# Altium project MegaD-328 16I(Bottom_board).PrjPcb
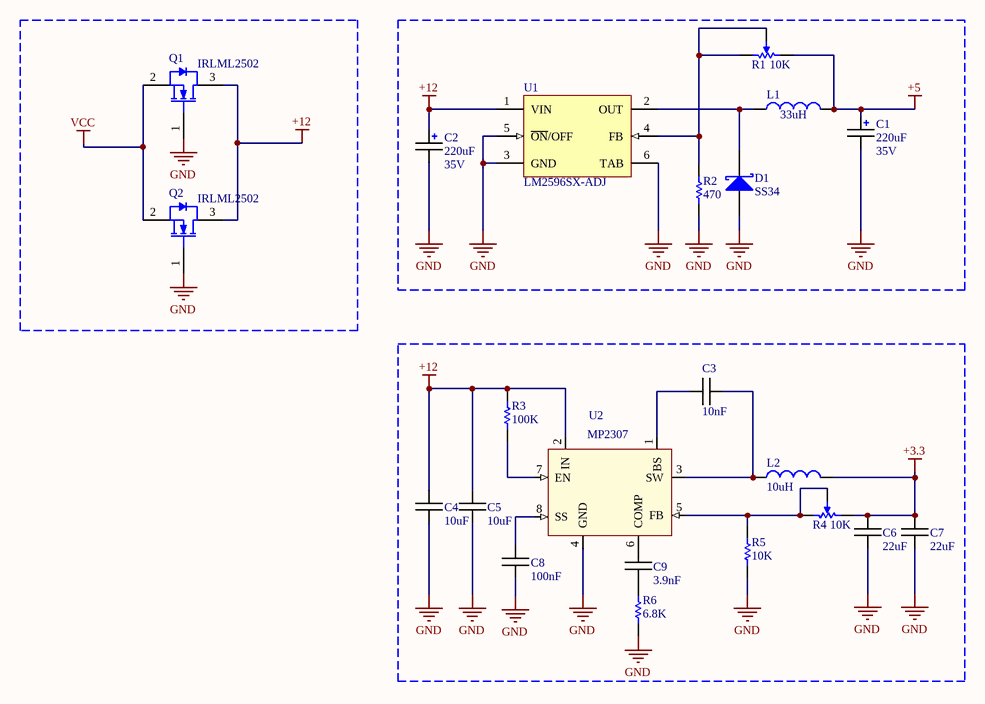
[diagram p0: Power.SchDoc]
2 sheets, 42 parts. Net scope: global (net labels, ports and power ports of the same name join across sheets).
Board file: Bottom_boaard.PcbDoc
Sheets:
  Power.SchDoc
  Bottom_board.SchDoc

## Sheet Power.SchDoc
size A4

### Parts
C1  Rated Capacitance: 220uF  Rated Voltage: 35V  [ECAP_SMD_8mmx10mm]  (hidden comment: CAP_ELEC_SMD)
C2  Rated Capacitance: 220uF  Rated Voltage: 35V  [ECAP_SMD_8mmx10mm]  (hidden comment: CAP_ELEC_SMD)
C3  Val: 10nF  [CAP0805]  (hidden comment: CAP_SMD)
C4  Val: 10uF  [CAPC1206(3216)170_L]  (hidden comment: CAP_SMD)
C5  Val: 10uF  [CAPC1206(3216)170_L]  (hidden comment: CAP_SMD)
C6  Val: 22uF  [CAPC1206(3216)170_L]  (hidden comment: CAP_SMD)
C7  Val: 22uF  [CAPC1206(3216)170_L]  (hidden comment: CAP_SMD)
C8  Val: 100nF  [CAP0805]  (hidden comment: CAP_SMD)
C9  Val: 3.9nF  [CAP0805]  (hidden comment: CAP_SMD)
D1  SS34  [DO-214]
L1  Inductance: 33uH  [SDR1006_SMD]
L2  value 10uH  [IHLP2525]  (hidden comment: Inductor power)
Q1  IRLML2502  [SOT23_L]
Q2  IRLML2502  [SOT23_L]
R1  value 10K  [BOUR-3296W]  (hidden comment: 3296W)
R2  Val: 470  [RES0805]  (hidden comment: RES_SMD)
R3  Val: 100K  [RES0805]  (hidden comment: RES_SMD)
R4  value 10K  [BOUR-3296W]  (hidden comment: 3296W)
R5  Val: 10K  [RES0805]  (hidden comment: RES_SMD)
R6  Val: 6.8K  [RES0805]  (hidden comment: RES_SMD)
U1  LM2596SX-ADJ  [KTT0005B_N]
U2  MP2307  [SOIC8N]

### Nets
+3.3: C6.2 C7.2 L2.2 R4.3
+5: C1.1 L1.2 R1.3
+12: C2.1 C4.2 C5.2 Q1.3(D) Q2.3(D) R3.2 U1.1(VIN) U2.2(IN)
GND: C1.2 C2.2 C4.1 C5.1 C6.1 C7.1 C8.1 D1.2(A) Q1.1(G) Q2.1(G) R2.1 R5.1 R6.1 U1.3(GND) U1.5(~{ON}/OFF) U1.6(TAB) U2.4(GND)
VCC: Q1.2(S) Q2.2(S)
NetC3_1: C3.1 U2.1(BS)
NetC3_2: C3.2 L2.1 U2.3(SW)
NetC8_2: C8.2 U2.8(SS)
NetC9_1: C9.1 R6.2
NetC9_2: C9.2 U2.6(COMP)
NetD1_1: D1.1(K) L1.1 U1.2(OUT)
NetR1_1: R1.1 R1.2 R2.2 U1.4(FB)
NetR3_1: R3.1 U2.7(EN)
NetR4_1: R4.1 R4.2 R5.2 U2.5(FB)

### Library data of the parts
C3-C9 = CAP_SMD: Ceramic capacitor, 0805
D1 = SS34: Schottky Rectifier
L1 = Inductor power: Inductor for Power Circuits; Manufacturer: TDK; Online Catalog: VLCFSeries; Catalog Drawings: VLCF50[20,20-(1,3),28-2]SeriesTopVLCF50[20,20-(1,3),28-2]SeriesFootprintVLCF50[20,20-(1,3)]SeriesSide; Current - Saturation: 2.62A; Frequency - Test: 100kHz; EDA / CAD Models: DownloadfromAcceleratedDesigns; Material - Core: Ferrite; Type: Wirewound; DC Resistance (DCR): 43mOhmMax; Tolerance: ±30%; Shielding: Shielded; Other Names: 445-4557-1; Size / Dimension: 0.197"Lx0.197"W(5.00mmx5.00mm); Datasheet Version: 04/2016; Package Description: 2-Pin Surface Mount Device, Body 5 x 5 mm; Package Reference: VLCF5020T-3; Package / Case: Nonstandard; Series: VLCF; Current Rating: 2.62A; Manufacturer URL: http://www.tdk.com/; Category: Inductors,Coils,Chokes; Height - Seated (Max): 0.079"(2.00mm); Mounting Technology: SurfaceMount; Family: FixedInductors; Datasheet URL: https://product.tdk.com/info/en/catalog/datasheets/inductor_commercial_power_vlcf5020-3_en.pdf; Standard Package: 1; Mounting Type: SurfaceMount; Operating Temperature: -40°C~105°C; Packaging: CutTape(CT)
L2 = Inductor power: Inductor for Power Circuits
Q1 Q2 = IRLML2502: N-Channel HEXFET(R) Power MOSFET, 20 V VDS, +/- 12 V VGS, 4.2 A, 3-Pin SOT23, RoHS, Tape and Reel; Manufacturer: International Rectifier; Drain-to-Source Voltage [Vdss]: 20V; Drain-Source On Resistance-Max: 0.045O; Qg Gate Charge: 8nC; Rated Power Dissipation: 1.25W; Package Reference: SOT-23-3; Manufacturer URL: http://internationalrectifier.com/; Package Description: 3-Pin Small Outline Transistor, Body 2.92 x 1.3 mm, Pitch 0.95 mm; Datasheet Version: Apr-14; Channel Type: N-Channel; Datasheet URL: https://datasheet.ciiva.com/6383/irlml2502pbf-6383216.pdf
R1 R4 = Potentiometer: 3296 - 3/8 ” Square Trimpot(R) Trimming Potentiometer,, +/- 10%, 0.5 W, -55 to 125 degC, 3-Pin THD, RoHS, Tube
U1 = LM2596SX-ADJ: SIMPLE SWITCHER® Power Converter 150 KHz 3A Step-Down Voltage Regulator, 5-pin TO-263; Manufacturer: Texas Instruments; PackageTopMarking: NSUZXYTTE#*LM2596S*-ADJ P+; PowerWise: N; PackageDescription: TO-263, Molded, .400 x .390 x .180in, 5 Lead, .067in Pitch, Surface Mount; RoHS: N; Code_JEDEC: MO-169-AB; CompType: Switcher; ComponentLink1Description: Datasheet URL; PackageReference: KTT0005B; PinCount: 5; ComponentLink1URL: http://www.ti.com/general/docs/lit/getliterature.tsp?genericPartNumber=LM2596&fileType=pdf
U2 = MP2307: Monolithic synchronous buck regulator

## Sheet Bottom_board.SchDoc
size A4
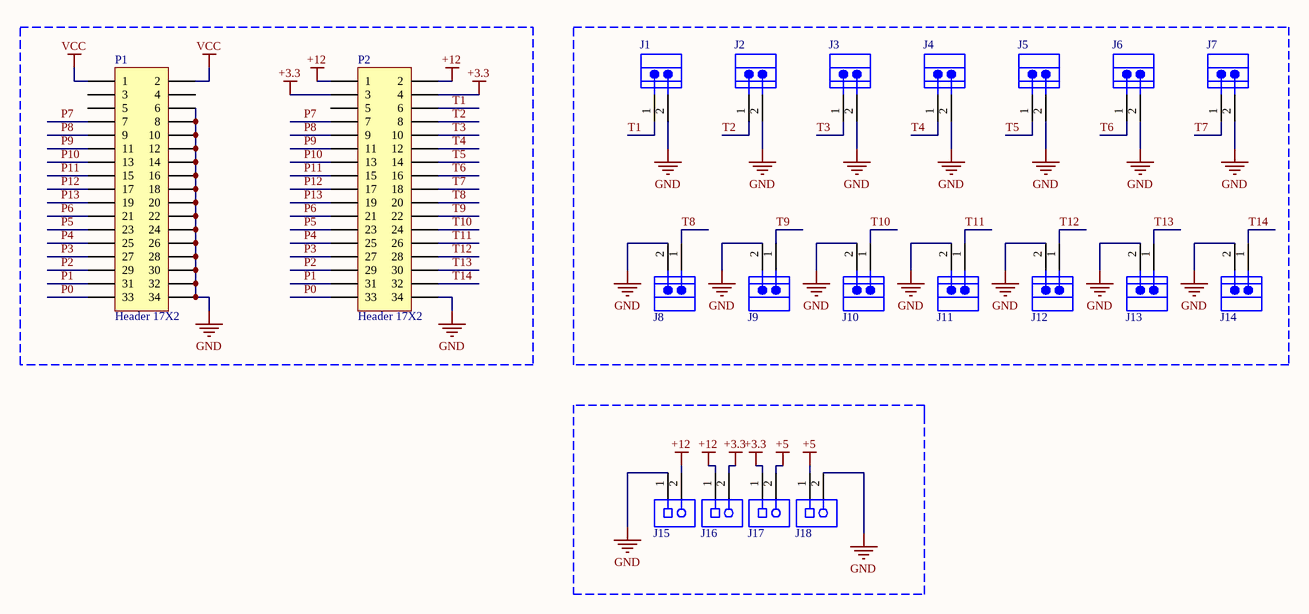
[diagram p1: Bottom_board.SchDoc]

### Parts
J1  (no value)  [KF350-3.5-02P]
J2  (no value)  [KF350-3.5-02P]
J3  (no value)  [KF350-3.5-02P]
J4  (no value)  [KF350-3.5-02P]
J5  (no value)  [KF350-3.5-02P]
J6  (no value)  [KF350-3.5-02P]
J7  (no value)  [KF350-3.5-02P]
J8  (no value)  [KF350-3.5-02P]
J9  (no value)  [KF350-3.5-02P]
J10  (no value)  [KF350-3.5-02P]
J11  (no value)  [KF350-3.5-02P]
J12  (no value)  [KF350-3.5-02P]
J13  (no value)  [KF350-3.5-02P]
J14  (no value)  [KF350-3.5-02P]
J15  (no value)  [PHOE-1729128-2_V]
J16  (no value)  [PHOE-1729128-2_V]
J17  (no value)  [PHOE-1729128-2_V]
J18  (no value)  [PHOE-1729128-2_V]
P1  Header 17X2  [HDR2X17]
P2  Header 17X2  [HDR2X17-PBD]

### Nets
+3.3: J16.2 J17.1 P2.3 P2.4
+5: J17.2 J18.1
+12: J15.2 J16.1 P2.1 P2.2
GND: J1.2 J2.2 J3.2 J4.2 J5.2 J6.2 J7.2 J8.2 J9.2 J10.2 J11.2 J12.2 J13.2 J14.2 J15.1 J18.2 P1.6 P1.8 P1.10 P1.12 P1.14 P1.16 P1.18 P1.20 P1.22 P1.24 P1.26 P1.28 P1.30 P1.32 P1.34 P2.34
VCC: P1.1 P1.2
P0: P1.33 P2.33
P1: P1.31 P2.31
P2: P1.29 P2.29
P3: P1.27 P2.27
P4: P1.25 P2.25
P5: P1.23 P2.23
P6: P1.21 P2.21
P7: P1.7 P2.7
P8: P1.9 P2.9
P9: P1.11 P2.11
P10: P1.13 P2.13
P11: P1.15 P2.15
P12: P1.17 P2.17
P13: P1.19 P2.19
T1: J1.1 P2.6
T2: J2.1 P2.8
T3: J3.1 P2.10
T4: J4.1 P2.12
T5: J5.1 P2.14
T6: J6.1 P2.16
T7: J7.1 P2.18
T8: J8.1 P2.20
T9: J9.1 P2.22
T10: J10.1 P2.24
T11: J11.1 P2.26
T12: J12.1 P2.28
T13: J13.1 P2.30
T14: J14.1 P2.32

Not connected (* = marked no-connect by the designer): P1 3 4 5; P2 5

### Library data of the parts
J1-J14 = Terminal_2: Euro Terminal Block, 6 A, 150 V, -40 to 105 degC, Pitch 2.54 mm, 1x2 Position, Height 8.6 mm, Tail Length 3.3 mm; Manufacturer: Cixi KaiFeng; PartNumber: KF120-02P-14; Rated Current: 6 A; Contact: Brass; Insulation Resistance: 5000 MOhm / 1000 V; Rated Voltage: 150 V; No. of Pole: 2; Withstanding Voltage: AC 1500 V / 1 Min; Contact Resistance: 20 mOhm; Pitch: Single Pitch; PackageReference: KF120-2; Color: Green; Mounting Technology: Through Hole; PackageDescription: Terminal Block, Pitch 2.54 mm, 1 x 2 Position, Height 8.6 mm, Tail Length 3.3 mm; ComponentLink2Description: Datasheet; ComponentLink1Description: Manufacturer URL; ComponentLink2URL: http://www.nb-kaifeng.com/upload/editor/ext_pdf/201305290533202245.pdf; Temp. Range: -40 to 105 degC; ComponentLink1URL: http://www.nb-kaifeng.com/
J15-J18 = Terminal_2_Green: PCB Terminal Block, 13.5 A, 400 V, 2-Pin THD, RoHS, Bulk; PartNumber: 1729128; Manufacturer: Phoenix Contact; Package Version: 03/2015; No. of Rows: 1; Pitch: 5.08mm; No. of Positions: 2; Voltage Rating: 400V; Current Rating: 13500mA; Manufacturer URL: http://www.phoenixcontact.com/; Datasheet URL: https://datasheet.ciiva.com/16046/1729128-16046181.pdf; RoHS: TRUE; Package URL: https://www.phoenixcontact.com/online/portal/pi/pxc/product_detail_page/!ut/p/b1/3VdJjqNKFDxLH8AFycySyWY2ozFsEPOMMQaDOX1XedGL_1Vdm5YXJleknhSKeBkvI6EA8ncAo3AYoDhBQGco6KN7VURTdemj9us_IEKEZo_YHiPAEWEFmDGOHMORkqKYCORBZxgL7ZoaZYcbFFUZ3fqxSY6GOuxydWUuHqz1ynmMFygu583Bob0Ewr6Sd_l-5m-kAueHiB0jpRwZwe58wwtkpxtMYd_LmGcDRU02dRNEyWt6Y2ti5pSyJ_reIkzIulrqApdnbT11V5jnCKbYNCvhEM1MCpPByat_X379-iThf08CI5GfOPqfBeS3BRoBOdD55AKVv0iLwCMq-2BrzXWSGRH7pUGD9uwXQjiph3xL0DKQwdGa0JImiIOmBNOestqgwTHSSs2oOep-78apyXQBvNi8ZLaFjvjWvcaUEBu0MC6Wbe-d6mB0FAebo2lUWinqYaZs5DAYzV0RP9yitUjnGJ0iI9xhZkT42OCQNUJJhkgWINNQLP2JFP6OpMg3JCVg70jqHT0lvKOnhHf0lPuOnnLf0VPuWx6_dxwUIvwk5WMkT0kLL1mh61l2yZVSzG3pYV_bqo-mj6uMKwKwdnnW8Jh5RTOJzMOA5c-eJDaZQw4mTMPH02PvS_ZAqNVjVTo2WyYLkwH_KU1mmmG5kjRhDqPXLwwVHvVOjCM60-fpXvTDfMGW1PVFVS1r4e4yVDk4ZdNbkUHvqPqQSeian4UD39fNKmachqdJ1NJbyk8rXT9mXTvPk3oE5meulKGgiruPJek-4I9hTT6G8ZLOyRSm2RRVbThERQad5OS28hdt4YW4vG0stgYYzsWsK4_7y6DZMjJSCqri1kyiZR5vD7pwIrNR7QwPHTcLTI5qT7eRlpHrdGiupYlqQDJ7zy_CND8fWWBoLRXxk1RVcXiBQwbTD4Xi7KL-FuO94t9xaqweXzH; Package Description: 2-Pin Through Hole Device, Body 8.1 x 10.16 mm, Pitch 5.08 mm; Datasheet Version: 12/2013; Mounting Technology: ThroughHole; Orientation: Horizontal; Package Reference: 1729128-2; Packing: Bulk
P1 P2 = Header 17X2: Header, 17-Pin, Dual row; LatestRevisionDate: 17-Jul-2002; LatestRevisionNote: Re-released for DXP Platform.; Publisher: Altium Limited

## Nets that join several sheets
+3.3: Power (C6.2 C7.2 L2.2 R4.3), Bottom_board (J16.2 J17.1 P2.3 P2.4)
+5: Power (C1.1 L1.2 R1.3), Bottom_board (J17.2 J18.1)
+12: Power (8 pins), Bottom_board (J15.2 J16.1 P2.1 P2.2)
GND: Power (17 pins), Bottom_board (32 pins)
VCC: Power (Q1.2 Q2.2), Bottom_board (P1.1 P1.2)